# EAGLE design satshakit (EAGLE 7.2.0)
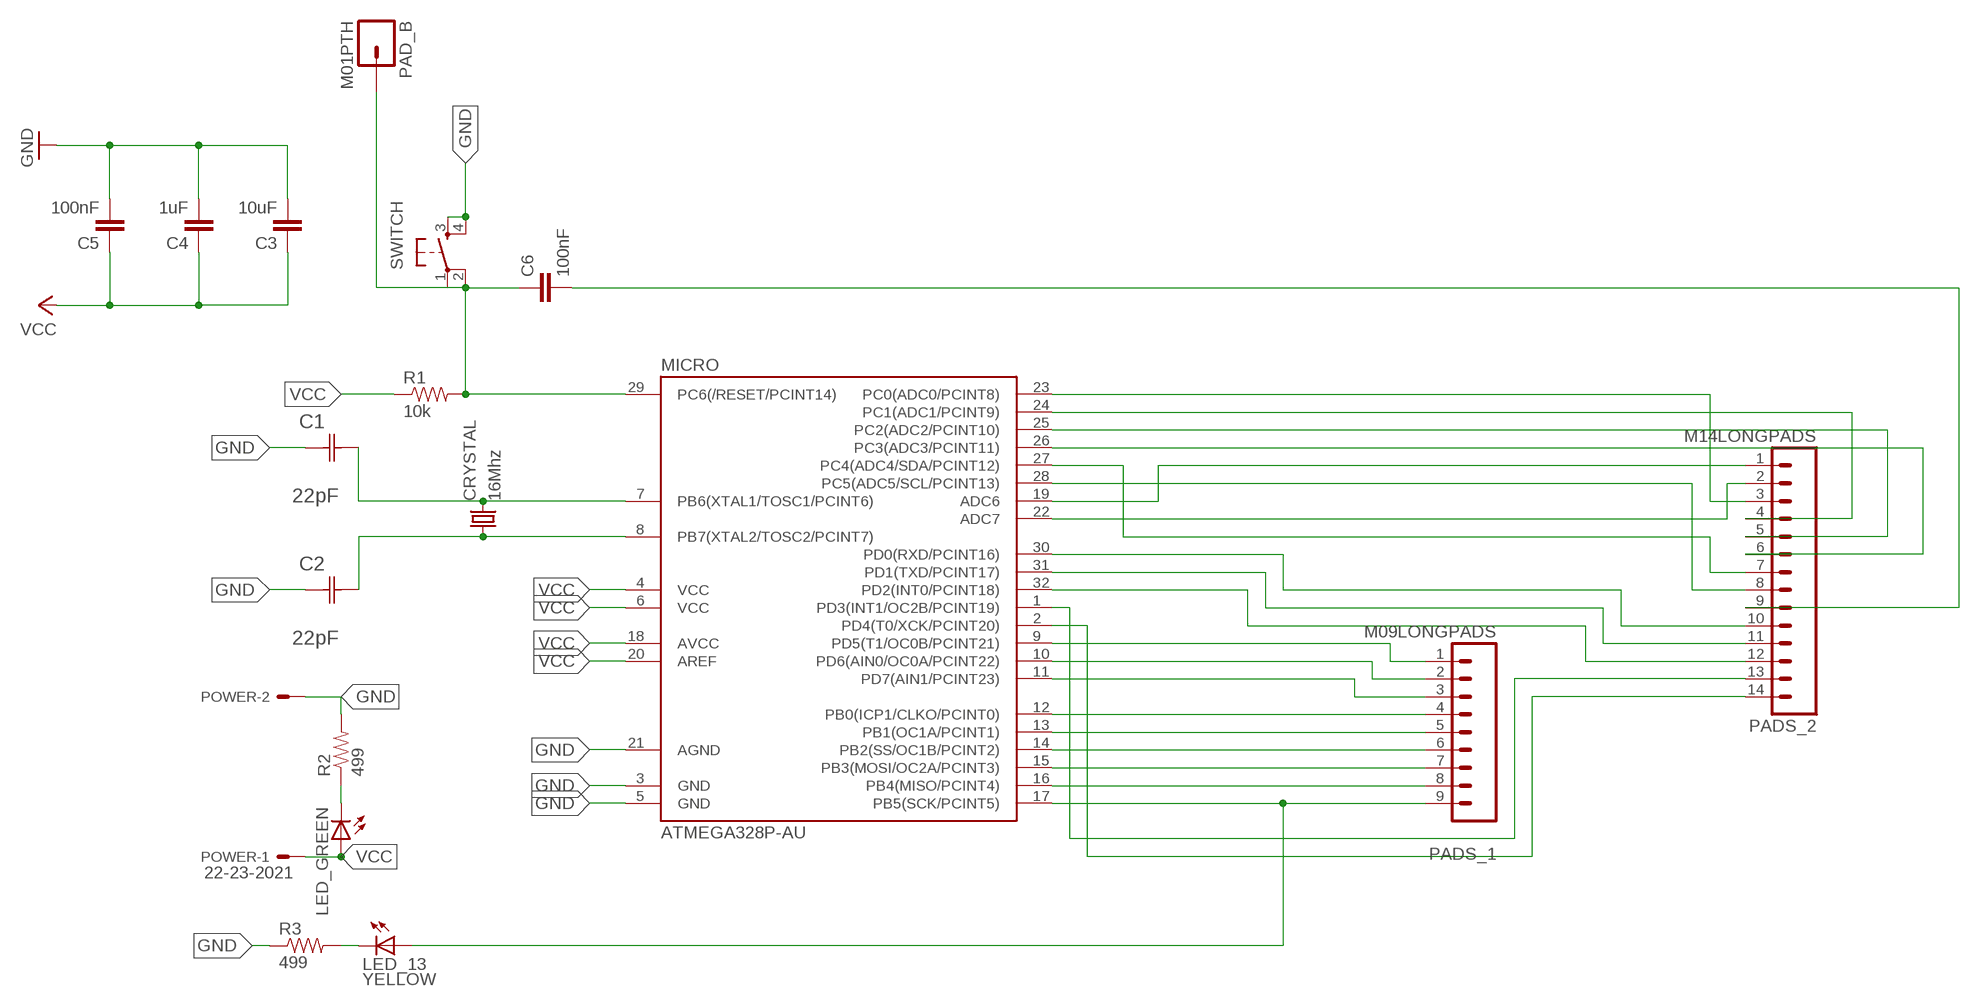
[diagram p0: schematic, sheet 1]

## Parts
C1  22pF  0612ZC225MAT2A  [CAPC3216X178N]
C2  22pF  0612ZC225MAT2A  [CAPC3216X178N]
C3  10uF  CAP1206  [1206]
C4  1uF  CAP1206  [1206]
C5  100nF  CAP1206  [1206]
C6  100nF  CAP1206  [1206]
CRYSTAL  16Mhz  CSM-7X-DU  [CSM-7X-DU]
LED_13  YELLOW  LED1206  [1206]
LED_GREEN  LED1206  [1206]
MICRO  ATMEGA328P-AU  ATMEGA48/88/168-AU  [TQFP32-08]
PAD_B  M01PTH  [1X01]
PADS_1  M09LONGPADS  [1X09_LONGPADS]
PADS_2  M14LONGPADS  [1X14-LONGPADS]
POWER  22-23-2021  [22-23-2021]
R1  10k  RESISTOR1206  [1206]
R2  499  RESISTOR1206  [1206]
R3  499  RESISTOR1206  [1206]
SWITCH  6MM_SWITCH6MM_SWITCH  [6MM_SWITCH]

## Nets
GND: C1.1(C1) C2.1(C1) C3.2 C4.2 C5.2 MICRO.3(GND) MICRO.5(GND) MICRO.21(AGND) POWER.2 R2.2 R3.1 SWITCH.3(S) SWITCH.4(S1)
N$1: MICRO.9(PD5(T1/OC0B/PCINT21)) PADS_1.1
N$2: C1.2(C2) CRYSTAL.2 MICRO.7(PB6(XTAL1/TOSC1/PCINT6))
N$3: C6.2 PADS_2.9
N$4: MICRO.10(PD6(AIN0/OC0A/PCINT22)) PADS_1.2
N$5: MICRO.11(PD7(AIN1/PCINT23)) PADS_1.3
N$6: MICRO.12(PB0(ICP1/CLKO/PCINT0)) PADS_1.4
N$7: MICRO.13(PB1(OC1A/PCINT1)) PADS_1.5
N$8: MICRO.14(PB2(SS/OC1B/PCINT2)) PADS_1.6
N$9: C2.2(C2) CRYSTAL.1 MICRO.8(PB7(XTAL2/TOSC2/PCINT7))
N$10: MICRO.15(PB3(MOSI/OC2A/PCINT3)) PADS_1.7
N$11: MICRO.16(PB4(MISO/PCINT4)) PADS_1.8
N$12: LED_13.1(A) MICRO.17(PB5(SCK/PCINT5)) PADS_1.9
N$13: MICRO.19(ADC6) PADS_2.1
N$14: MICRO.22(ADC7) PADS_2.2
N$15: MICRO.23(PC0(ADC0/PCINT8)) PADS_2.3
N$16: MICRO.24(PC1(ADC1/PCINT9)) PADS_2.4
N$17: MICRO.25(PC2(ADC2/PCINT10)) PADS_2.5
N$18: MICRO.26(PC3(ADC3/PCINT11)) PADS_2.6
N$19: MICRO.27(PC4(ADC4/SDA/PCINT12)) PADS_2.7
N$20: MICRO.30(PD0(RXD/PCINT16)) PADS_2.10
N$21: MICRO.31(PD1(TXD/PCINT17)) PADS_2.11
N$22: MICRO.32(PD2(INT0/PCINT18)) PADS_2.12
N$23: MICRO.1(PD3(INT1/OC2B/PCINT19)) PADS_2.13
N$24: MICRO.2(PD4(T0/XCK/PCINT20)) PADS_2.14
N$25: MICRO.28(PC5(ADC5/SCL/PCINT13)) PADS_2.8
N$26: LED_GREEN.2(C) R2.1
N$27: LED_13.2(C) R3.2
N$28: C6.1 MICRO.29(PC6(/RESET/PCINT14)) PAD_B.1 R1.2 SWITCH.1(P) SWITCH.2(P1)
VCC: C3.1 C4.1 C5.1 LED_GREEN.1(A) MICRO.4(VCC) MICRO.6(VCC) MICRO.18(AVCC) MICRO.20(AREF) POWER.1 R1.1

## Library data of the parts
C1 C2 = AVX_By_element14_Batch_1:0612ZC225MAT2A: Capacitor 1206; MPN: 0612ZC225MAT2A; OC_FARNELL: -; OC_NEWARK: 12N3209; SUPPLIER: AVX; TOLERANCE: ±20%; VALUE: 2.2µF; VOLTAGERATING: 10V
C3-C6 = 01_SparkFun:CAP: Capacitor Standard 0603 ceramic capacitor, and 0.1" leaded capacitor.
CRYSTAL = 01_FAB_Hello:CSM-7X-DU: SMD CRYSTAL Source: www.ecsxtal.com .. Crystal 3.6864MHz CSM_7X_DU.PDF; OC_FARNELL: unknown; OC_NEWARK: unknown
LED_13 LED_GREEN = 01_FAB_Hello:LED
MICRO = atmega8:ATMEGA48/88/168
PAD_B = 01_SparkFun:M01: Header 1 Standard 1-pin 0.1" header. Use with straight break away headers (SKU : PRT-00116), right angle break away headers (PRT-00553), swiss pins (PRT-00743), machine pins (PRT-00117), and female headers (PRT-00115).
PADS_1 = 01_SparkFun:M09: Header 9 Standard 9-pin 0.1" header. Use with straight break away headers (SKU : PRT-00116), right angle break away headers (PRT-00553), swiss pins (PRT-00743), machine pins (PRT-00117), and female headers (PRT-00115).
PADS_2 = 01_SparkFun:M14: Header 14 Standard 14-pin 0.1" header. Use with straight break away headers (SKU : PRT-00116), right angle break away headers (PRT-00553), swiss pins (PRT-00743), machine pins (PRT-00117), and female headers (PRT-00115).
POWER = con-molex:22-23-2021: .100" (2.54mm) Center Header - 2 Pin; MF: MOLEX; MPN: 22-23-2021; OC_FARNELL: 1462926; OC_NEWARK: 25C3832
R1-R3 = 01_SparkFun:RESISTOR: Resistor Basic schematic elements and footprints for 0603, 1206, and PTH 1/10th watt (small) resistors.
SWITCH = 01_FAB_Hello:6MM_SWITCH: OMRON SWITCH

## Board
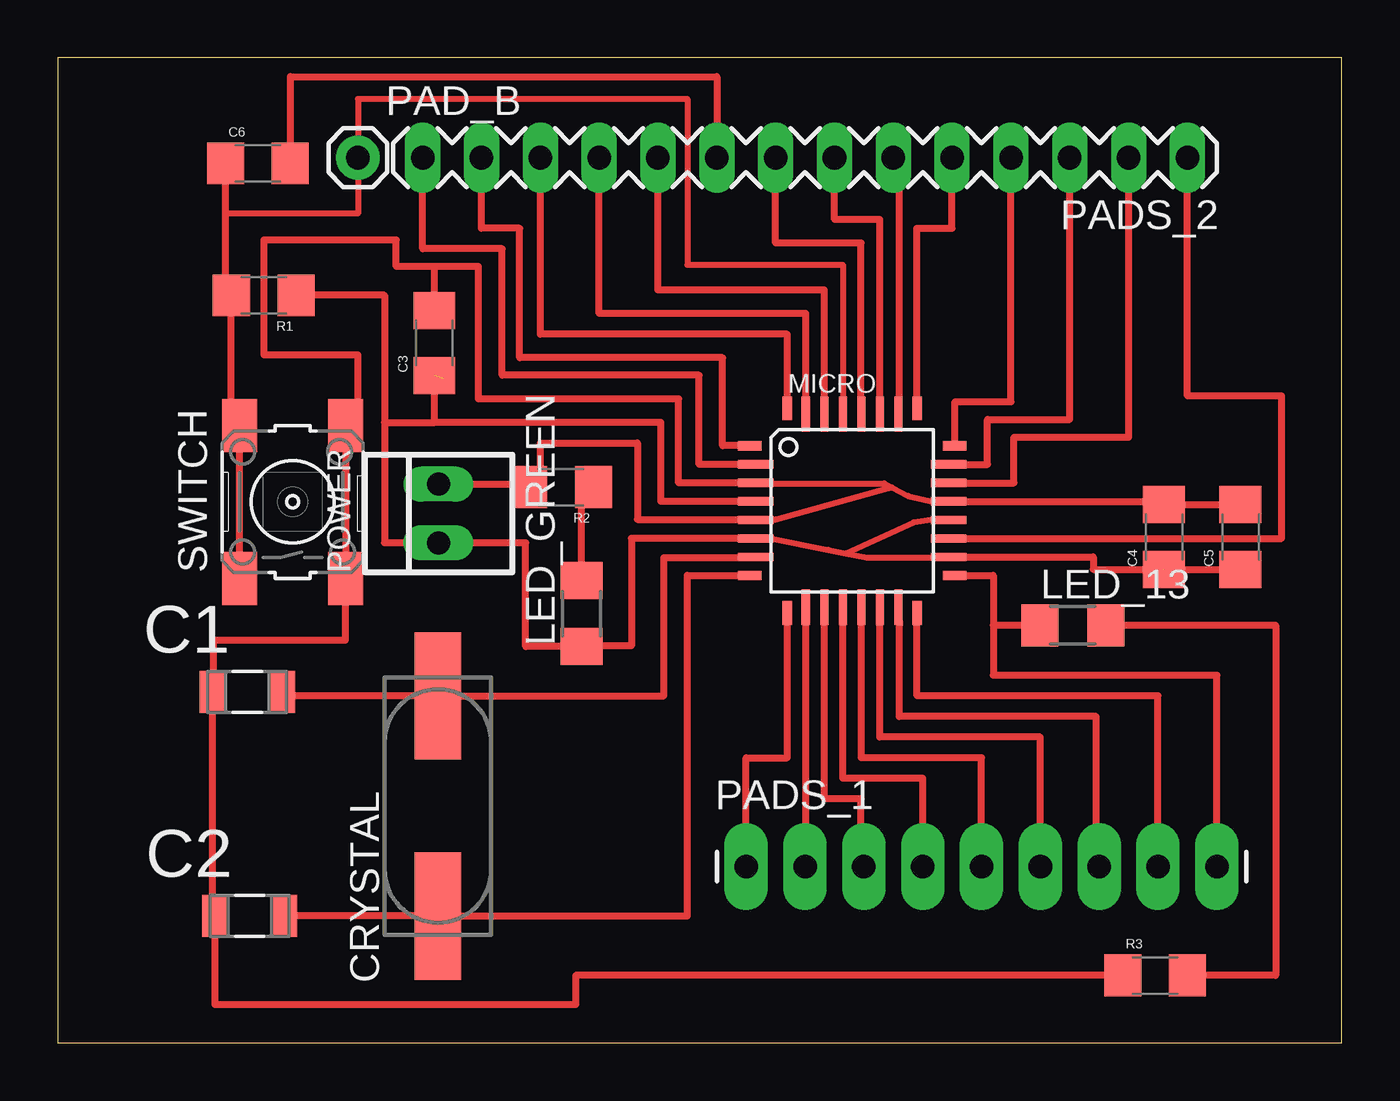
[diagram p1: board, top side]

Size 55.42 x 42.54 mm. Coordinates in mm from the lower left corner, seen from the top.
Outline: 0,0 55.42,0 55.42,42.54 0,42.54 0,0
Copper layers (1*16): Top 0.035mm / dielectric 1.5mm / Bottom 0.035mm
Design rules "default": minimum track width 10mil, minimum drill 24mil, track to track 8mil, track to pad 8mil, pad to pad 8mil, via to via 8mil, smd to smd 8mil, copper to edge 40mil, drill to drill 8mil, minimum pad ring 10mil, minimum via ring 8mil, stop-mask expansion 4mil, vias tented up to drill 0mil, thermal gap 10mil

### Footprints (pad centres in the part's own frame; a part is rotated, then mirrored left to right if it is on the bottom)
CAPC3216X178N = smd 1.118 x 1.803: 1 -1.499,0; 2 1.499,0
1206 = smd 1.6 x 1.8: 1 -1.4,0; 2 1.4,0
CSM-7X-DU = smd 5.5 x 2: 1 -4.75,0; 2 4.75,0
1206' = smd 1.6 x 1.803: 1 -1.422,0; 2 1.422,0
TQFP32-08 = smd 1.016 x 0.406: 1 -4.42,2.8; 8 -4.42,-2.8; 17 4.42,-2.8; 24 4.42,2.8 | smd 1.524 x 0.356: 2 -4.166,2; 3 -4.166,1.2; 4 -4.166,0.4; 5 -4.166,-0.4; 6 -4.166,-1.2; 7 -4.166,-2; 18 4.166,-2; 19 4.166,-1.2; 20 4.166,-0.4; 21 4.166,0.4; 22 4.166,1.2; 23 4.166,2 | smd 0.406 x 1.016: 9 -2.8,-4.42; 16 2.8,-4.42; 25 2.8,4.42; 32 -2.8,4.42 | smd 0.356 x 1.524: 10 -2,-4.166; 11 -1.2,-4.166; 12 -0.4,-4.166; 13 0.4,-4.166; 14 1.2,-4.166; 15 2,-4.166; 26 2,4.166; 27 1.2,4.166; 28 0.4,4.166; 29 -0.4,4.166; 30 -1.2,4.166; 31 -2,4.166
1X01 = drill 1.016 pad 1.88: 1 0,0
1X09_LONGPADS = drill 1.016 pad 1.88 long: 1 0,0; 2 2.54,0; 3 5.08,0; 4 7.62,0; 5 10.16,0; 6 12.7,0; 7 15.24,0; 8 17.78,0; 9 20.32,0
1X14-LONGPADS = drill 1.016 long: 1 0,0; 2 2.54,0; 3 5.08,0; 4 7.62,0; 5 10.16,0; 6 12.7,0; 7 15.24,0; 8 17.78,0; 9 20.32,0; 10 22.86,0; 11 25.4,0; 12 27.94,0; 13 30.48,0; 14 33.02,0
22-23-2021 = drill 1 long: 1 -1.27,0; 2 1.27,0
6MM_SWITCH = smd 2.286 x 1.524: 1 -3.302,2.286; 2 3.302,2.286; 3 -3.302,-2.286; 4 3.302,-2.286

### Placement (x,y rotation side)
C1  8.18,15.16 0 top
C2  8.28,5.49 0 top
C3  16.26,30.23 90 top
C4  47.75,21.84 90 top
C5  51.05,21.84 90 top
C6  8.64,37.97 0 top
CRYSTAL  16.41,10.24 90 top
LED_13  YELLOW  [1206']  43.81,18.03 0 top
LED_GREEN  [1206']  22.61,18.54 90 top
MICRO  34.29,22.99 0 top
PAD_B  12.95,38.23 0 top
PADS_1  29.72,7.62 0 top
PADS_2  48.77,38.23 180 top
POWER  16.43,22.86 90 top
R1  8.89,32.28 180 top
R2  21.72,24 180 top
R3  47.37,2.92 0 top
SWITCH  10.13,23.37 90 top

### Tracks (layer width: path | path; a pad name or v marks a point on that pad's centre or on a via)
GND
  Top 0.254: MICRO.3 30.15,24.16 35.68,24.16 | 35.68,24.16 36.7,23.62 37.85,23.37 | 30.73,22.61 30.99,22.61 35.86,23.95 | 35.86,23.95 36,23.99 | 35.68,24.16 35.86,23.95
  Top 0.305: MICRO.5 | MICRO.21 | C1.1 6.68,5.49 C2.1 6.78,1.65 22.35,1.65 22.35,2.92 R3.1 | C1.1 6.6,15.16 | MICRO.5 30.12,22.61 25.02,22.61 25.02,25.91 20.83,25.91 20.83,23.88 20.82,23.88 R2.2 20.82,24.13 POWER.2 | C1.1 6.73,15.16 6.73,17.4 12.42,17.4 SWITCH.3 SWITCH.4 12.95,26.54 12.95,29.72 8.89,29.72 8.89,34.67 14.61,34.67 14.61,33.53 16.26,33.53 | MICRO.21 47.75,23.39 C4.2 C5.2 | 30.73,22.61 MICRO.5 | MICRO.21 37.85,23.37 | MICRO.3 26.8,24.19 26.8,27.81 18.16,27.81 18.16,33.53 16.26,33.53 | C3.2 16.26,33.53
N$1
  Top 0.305: PADS_1.1 29.72,12.32 31.49,12.32 MICRO.9
N$2
  Top 0.305: 9.68,14.99 C1.2 9.68,14.99 | MICRO.7 30.12,20.95 26.16,20.95 26.16,14.99 CRYSTAL.2 9.68,14.99
N$3
  Top 0.305: PADS_2.9 28.45,41.73 10.04,41.73 C6.2
N$4
  Top 0.305: PADS_1.2 32.29,7.62 MICRO.10
N$5
  Top 0.305: PADS_1.3 34.67,7.62 34.67,10.54 33.09,10.54 MICRO.11
N$6
  Top 0.305: 33.91,18.82 MICRO.12 33.89,11.43 37.34,11.43 PADS_1.4
N$7
  Top 0.305: PADS_1.5 39.88,12.32 34.69,12.32 MICRO.13
N$8
  Top 0.305: PADS_1.6 42.42,13.21 35.49,13.21 MICRO.14
N$9
  Top 0.305: 9.78,5.46 C2.2 | MICRO.8 27.18,20.19 27.18,5.49 CRYSTAL.1 C2.2 | C2.2
N$10
  Top 0.305: PADS_1.7 44.83,7.62 44.83,14.1 36.32,14.1 36.32,18.03 MICRO.15
N$11
  Top 0.305: MICRO.16 37.09,14.99 47.5,14.99 PADS_1.8
N$12
  Top 0.305: PADS_1.9 50.04,15.88 40.39,15.88 40.39,18.03 | LED_13.1 40.39,18.03 | MICRO.17 40.39,20.19 40.39,18.03
N$13
  Top 0.305: MICRO.19 52.83,21.79 52.83,27.94 48.77,27.94 PADS_2.1
N$14
  Top 0.305: MICRO.22 41.28,24.19 41.28,26.16 46.23,26.16 PADS_2.2
N$15
  Top 0.305: MICRO.23 40.13,24.99 40.13,26.92 43.69,26.92 PADS_2.3
N$16
  Top 0.305: PADS_2.4 41.15,27.69 38.73,27.69 38.73,25.79 MICRO.24
N$17
  Top 0.305: MICRO.25 37.08,35.18 38.61,35.18 PADS_2.5
N$18
  Top 0.305: MICRO.26 36.32,27.15 36.32,37.34 arc-90 36.07,37.59 PADS_2.6
N$19
  Top 0.305: MICRO.27 35.49,35.56 33.53,35.56 PADS_2.7
N$20
  Top 0.305: MICRO.30 33.09,32.51 25.91,32.51 PADS_2.10
N$21
  Top 0.305: MICRO.31 32.29,31.5 23.37,31.5 PADS_2.11
N$22
  Top 0.305: PADS_2.12 20.83,30.61 31.5,30.61 MICRO.32
N$23
  Top 0.305: MICRO.1 28.7,25.79 28.7,29.59 19.94,29.59 19.94,35.18 18.29,35.18 PADS_2.13
N$24
  Top 0.305: MICRO.2 27.69,24.99 27.69,28.83 19.18,28.83 19.18,34.29 15.75,34.29 PADS_2.14
N$25
  Top 0.305: MICRO.28 34.67,27.15 34.67,34.54 30.99,34.54 PADS_2.8
N$26
  Top 0.305: 23.5,23.75 R2.1 23.12,23.62 22.61,23.62 LED_GREEN.2
N$27
  Top 0.305: R3.2 52.58,2.92 52.58,18.03 LED_13.2
N$28
  Top 0.254: MICRO.29 33.89,33.6 27.18,33.6 27.18,40.77 12.95,40.77 PAD_B.1 12.95,35.81 7.24,35.81
  Top 0.305: SWITCH.1 SWITCH.2 | SWITCH.2 8.25,26.67 | SWITCH.2 7.49,26.67 R1.2 7.24,32.28 7.24,35.81 C6.1
  Top 0.406: SWITCH.1 7.75,20.07
VCC  (2 unrouted)
  Top 0.254: 30.81,21.79 33.27,21.29 34.02,21.14 | 34.02,21.14 34.92,20.95 38.46,20.95 | MICRO.20 37.85,22.59 37.85,22.61 36.96,22.48 34.02,21.14
  Top 0.305: MICRO.18 | MICRO.20 37.85,22.61 | MICRO.4 26.04,23.39 26.04,26.8 16.26,26.8 | 14.1,26.8 14.1,32.28 R1.1 | 14.1,26.8 14.1,21.59 POWER.1 20.19,21.59 20.19,17.12 LED_GREEN.1 22.61,17.14 24.77,17.14 24.77,21.79 MICRO.6 30.81,21.79 | 38.46,20.95 MICRO.18 | MICRO.18 44.7,20.99 44.7,20.45 C4.1 | 16.64,28.7 16.64,28.58 | 14.1,26.8 16.26,26.8 | 16.26,26.8 C3.1 | C4.1 C5.1